# EAGLE design Wired Door Bell (EAGLE 9.6.1)
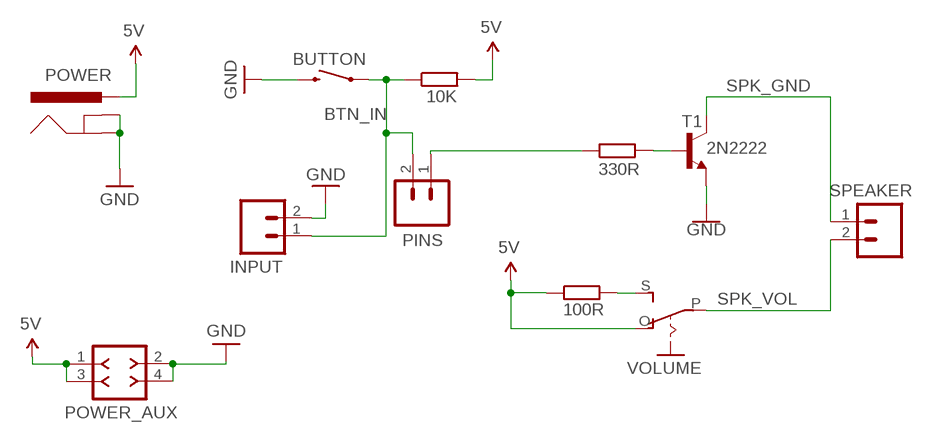
[diagram p0: schematic, sheet 1]

## Parts
10K  10k  R-EU_0309/V  [0309V]
100R  100  R-EU_0309/V  [0309V]
330R  330  R-EU_0309/V  [0309V]
BUTTON  MOMENTARY-SWITCH-SPST-PTH-6.0MM  [TACTILE_SWITCH_PTH_6.0MM]
INPUT  CONN_02  [1X02]
PINS  CONN_02  [1X02]
POWER  POWER_JACK  [POWER_JACK_PTH]
POWER_AUX  F-2X02-DIL-100  [DIL-100-2X02]
SPEAKER  CONN_02  [1X02]
T1  2N2222  [TO92-EBC-OVAL]
VOLUME  EG1218S  [EG1218]

## Nets
5V: 10K.2 100R.1 POWER.PWR POWER_AUX.1 POWER_AUX.3 VOLUME.O
BTN_IN: 10K.1 BUTTON.1 INPUT.1 PINS.2
GND: BUTTON.3 INPUT.2 POWER.GND POWER.GNDBREAK POWER_AUX.2 POWER_AUX.4 T1.E
MIN: 100R.2 VOLUME.S
SPK_GND: SPEAKER.1 T1.C
SPK_PWM: 330R.1 PINS.1
SPK_SIG: 330R.2 T1.B
SPK_VOL: SPEAKER.2 VOLUME.P

## Library data of the parts
10K 100R 330R = rcl:R-EU_: RESISTOR, European symbol; SPICEPREFIX: R
BUTTON = SparkFun-Switches:MOMENTARY-SWITCH-SPST: Momentary Switch (Pushbutton) - SPST Normally-open (NO) SPST momentary switches (buttons, pushbuttons). Variants PTH-12MM - 12mm square, through-hole Momentary Pushbutton Switch - 12mm Square <https://www.sparkfun.com/products/9190> (COM-09190) PTH-6.0MM, PTH-6.0MM-KIT - 6.0mm square, through-hole Mini Pushbutton Switch <https://www.sparkfun.com/products/97> (COM-00097) KIT package intended for soldering kit's - only one side of pads' copper is exposed. PTH-RIGHT-ANGLE-KIT - Right-angle, through-hole Right Angle Tactile Button <https://www.sparkfun.com/products/10791> - Used on SparkFun BigTime Watch Kit <https://www.sparkfun.com/products/11734> SMD-12MM - 12mm square, surface-mount Tactile Button - SMD (12mm) <https://www.sparkfun.com/products/12993> (COM-12993) Used on SparkFun PicoBoard <https://www.sparkfun.com/products/11888> SMD-4.5MM - 4.5mm Square Trackball Switch Used on SparkFun Blackberry Trackballer Breakout <https://www.sparkfun.com/products/13169> SMD-4.6MMX2.8MM - 4.60mm x 2.80mm, surface mount Used on SparkFun SAMD21 Mini Breakout <https://www.sparkfun.com/products/13664> SMD-5.2MM, SMD-5.2-REDUNDANT - 5.2mm square, surface-mount Mini Pushbutton Switch - SMD <https://www.sparkfun.com/products/8720> (COM-08720) Used on Arduino Pro Mini <https://www.sparkfun.com/products/11114> REDUNDANT package connects both switch circuits together SMD-6.0X3.5MM - 6.0 x 3.5mm, surface mount Momentary Reset Switch SMD <https://www.sparkfun.com/products/8229> (COM-08229) SMD-6.2MM-TALL - 6.2mm square, surface mount Tactile Button - SMD (6mm) <https://www.sparkfun.com/products/12992> Used on SparkFun Digital Sandbox <https://www.sparkfun.com/products/12651> SMD-RIGHT-ANGLE - Right-angle, surface mount Used on SparkFun Block for Intel® Edison - Arduino <https://www.sparkfun.com/products/13036>; PROD_ID: SWCH-08441; SF_SKU: COM-00097
INPUT PINS SPEAKER = SparkFun-Connectors:CONN_02: Multi connection point. Often used as Generic Header-pin footprint for 0.1 inch spaced/style header connections On any of the 0.1 inch spaced packages, you can populate with these: Break Away Headers - Straight <https://www.sparkfun.com/products/116> (PRT-00116) Break Away Male Headers - Right Angle <https://www.sparkfun.com/products/553> (PRT-00553) Female Headers <https://www.sparkfun.com/products/115> (PRT-00115) Break Away Headers - Machine Pin <https://www.sparkfun.com/products/117> (PRT-00117) Break Away Female Headers - Swiss Machine Pin <https://www.sparkfun.com/products/743> (PRT-00743) For SCREWTERMINALS and SPRING TERMINALS visit here: Screw Terimnals on SparkFun.com <https://www.sparkfun.com/search/results?term=Screw+Terminals> (5mm/3.5mm/2.54mm spacing) This device is also useful as a general connection point to wire up your design to another part of your project. Our various solder wires solder well into these plated through hole pads. Hook-Up Wire - Assortment (Stranded, 22 AWG) <https://www.sparkfun.com/products/11375> (PRT-11375) Hook-Up Wire - Assortment (Solid Core, 22 AWG) <https://www.sparkfun.com/products/11367> (PRT-11367) View the entire wire category on our website here <https://www.sparkfun.com/categories/141> Special notes: Molex polarized connector foot print use with: PRT-08233 with associated crimp pins and housings. 2.54_SCREWTERM for use with PRT-10571. 3.5mm Screw Terminal footprints for PRT-08084 5mm Screw Terminal footprints for use with PRT-08432
POWER = SparkFun-Connectors:POWER_JACK: Power Jack Connector This is the standard 5.5mm barrel jack for power. The PTH is the most common, proven, reliable, footprint. The Slot footprint only works if the mill layer is transmitted to the PCB fab house so be warned. Here are the connectors we sell at SparkFun: DC Barrel Power Jack/Connector <https://www.sparkfun.com/products/119> (PRT-00119) DC Barrel Power Jack/Connector (SMD) <https://www.sparkfun.com/products/12748> (PRT-12748) DC Barrel Jack Adapter - Breadboard Compatible <https://www.sparkfun.com/products/10811> (PRT-10811) It is used on this SparkFun product (and many, many others): SparkFun RedBoard - Programmed with Arduino <https://www.sparkfun.com/products/12757> (DEV-12757) Also, if you need a mating power supply or connector, please check these out: Wall Adapter Power Supply - 9VDC 650mA <https://www.sparkfun.com/products/298> (TOL-00298) DC Barrel Jack Adapter - Male <https://www.sparkfun.com/products/10287> (PRT-10287); PROD_ID: CONN-08197
POWER_AUX = con-headers-jp:F-2X02-: FEMALE HEADER
T1 = adafruit:2N2222: NPN TRANSISTOR Big oval pads
VOLUME = adafruit:EG1218: SLIDING SWITCH 0.1" spacing through hole, vertical SPDT slide switch http://www.ladyada.net/library/pcb/eaglelibrary.html

## Board
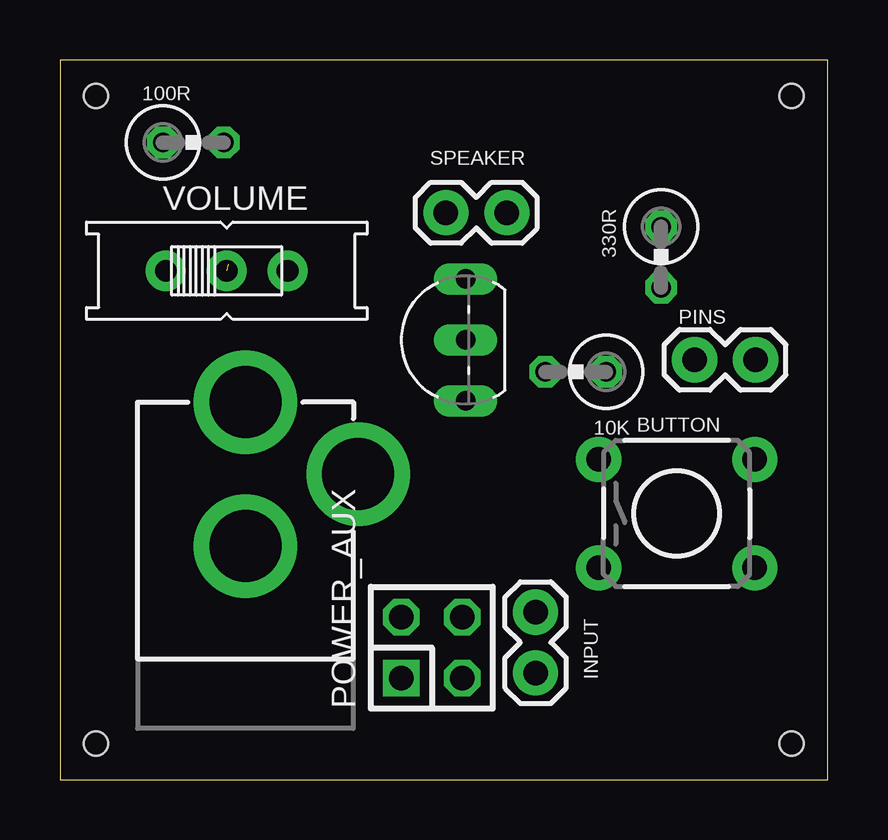
[diagram p1: board, top side]
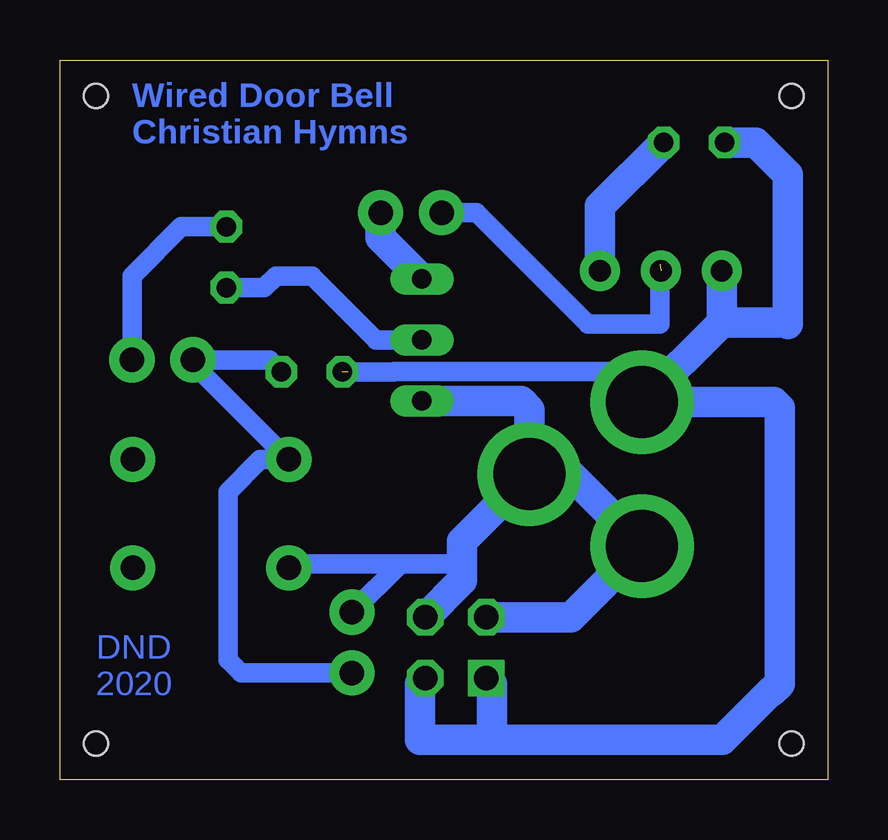
[diagram p2: board, bottom side, seen from below]

Size 32 x 30 mm. Coordinates in mm from the lower left corner, seen from the top.
Outline: 0,0 32,0 32,30 0,30 0,0
Copper layers (1*16): Top 0.035mm / dielectric 1.5mm / Bottom 0.035mm
Design rules "default": minimum track width 6mil, minimum drill 0.35mm, track to track 6mil, track to pad 6mil, pad to pad 6mil, via to via 6mil, smd to smd 6mil, copper to edge 40mil, drill to drill 6mil, minimum pad ring 10mil, minimum via ring 8mil, stop-mask expansion 4mil, vias tented up to drill 0mil, thermal gap 10mil
Holes 1 mm at 1.5,1.5 30.5,28.5 30.5,1.5 1.5,28.5

### Footprints (pad centres in the part's own frame; a part is rotated, then mirrored left to right if it is on the bottom)
0309V = drill 0.813 octagon: 1 -1.27,0; 2 1.27,0
TACTILE_SWITCH_PTH_6.0MM = drill 1.016 pad 1.88: 1 -3.251,2.261; 2 3.251,2.261; 3 -3.251,-2.261; 4 3.251,-2.261
1X02 = drill 1.016 pad 1.88: 1 0,0; 2 2.54,0
POWER_JACK_PTH = drill 2.997 pad 4.318: GND 0,7.7; GNDBREAK 4.7,10.7; PWR 0,13.7
DIL-100-2X02 = drill 1.016 square: 1 -1.27,-1.27 | drill 1.016 octagon: 2 -1.27,1.27; 3 1.27,-1.27; 4 1.27,1.27
TO92-EBC-OVAL = drill 0.813 long: B 0,-1.27; C 2.54,-1.27; E -2.54,-1.27
EG1218 = drill 0.9 pad 1.676: O -2.54,0; P 0,0; S 2.54,0

### Placement (x,y rotation side)
10K  21.5,17 180 top
100R  5.56,26.56 0 top
330R  25.06,21.78 270 top
BUTTON  25.71,11.09 0 top
INPUT  19.83,4.44 90 top
PINS  29,17.5 180 top
POWER  7.73,2.03 0 top
POWER_AUX  15.5,5.5 0 top
SPEAKER  18.63,23.63 180 top
T1  15.64,18.33 90 top
VOLUME  6.95,21.21 0 top

### Tracks (layer width: path | path; a pad name or v marks a point on that pad's centre or on a via)
5V  (1 unrouted)
  Bottom 0.813: 3,26.56 3,26.35 | 20,17 18.09,17 18.07,17.01 9.01,17.01 POWER.PWR
  Bottom 1.27: 14,1.65 4.39,1.65 2.39,3.65 2.35,3.65 2,4 2,15.5 2.23,15.73 POWER.PWR 4.41,19.05 | 14,1.65 17,1.65 17,4 POWER_AUX.3 | 4.41,19.05 VOLUME.O | 4.41,19.05 1.7,19.05 | 1.7,19.05 1.65,19 | 1.7,19.05 1.65,19.11 1.65,25.21 3,26.56 100R.1 | 14,1.65 14,4 POWER_AUX.1
BTN_IN
  Bottom 0.813: INPUT.1 24.44,4.44 25,5 25,12 23.65,13.35 BUTTON.1 26.46,17.35 PINS.2 23.27,17.5 10K.1
GND
  Bottom 0.813: 15.24,9 17.81,9 | 17.81,9 INPUT.2 | 17.81,9 22.29,9 BUTTON.3
  Bottom 1.27: POWER.GNDBREAK 10.73,12.73 POWER.GND 10.69,6.77 POWER_AUX.2 | POWER.GNDBREAK 15.24,9.92 15.24,9 15.24,8.3 POWER_AUX.4 | POWER.GNDBREAK 12.43,15.41 12.79,15.79 T1.E
MIN
  Bottom 1.27: 100R.2 9.49,23.9 VOLUME.S
SPK_GND
  Bottom 1.27: T1.C 18.63,22.59 SPEAKER.1
SPK_PWM
  Bottom 0.813: PINS.1 29,21 26.95,23.05 330R.1
SPK_SIG
  Bottom 0.813: 330R.2 23.49,20.51 23,21 21.5,21 18.83,18.33 T1.B
SPK_VOL  (1 unrouted)
  Bottom 0.813: SPEAKER.2 14.63,23.63 10,19 7,19 7,21.5

### Text on the board
Bottom: Wired Door Bell / Christian Hymns | DND / 2020